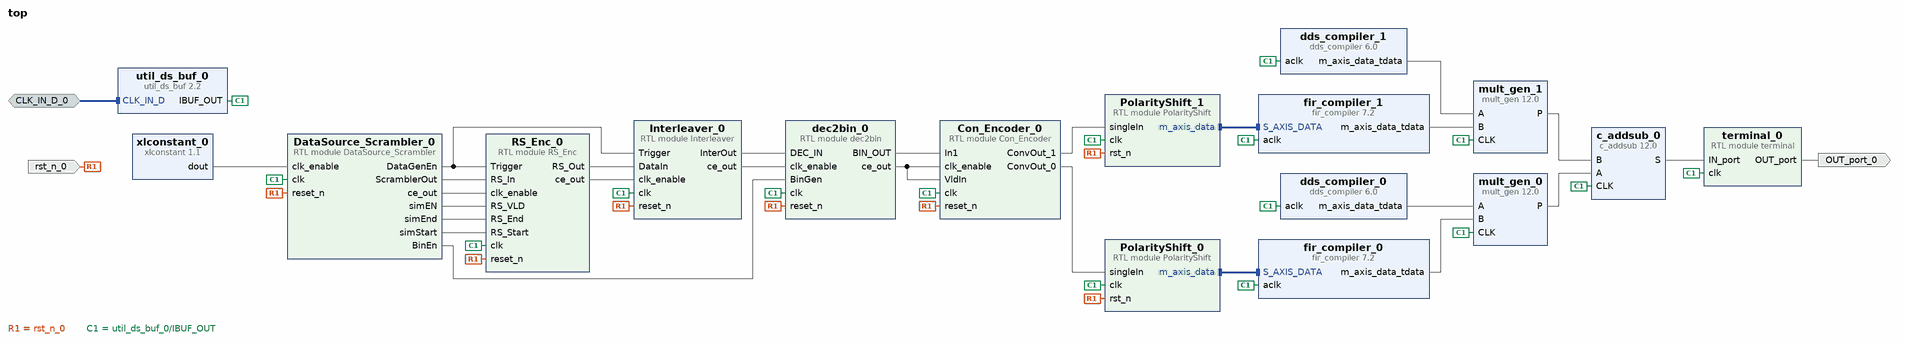
[diagram p0: block diagram of the top level]
# Vivado block design top, xc7k325tffg900-2, Vivado 2023.2
create_bd_design top

create_bd_intf_port -mode Slave -vlnv xilinx.com:interface:diff_clock_rtl:1.0 CLK_IN_D_0
create_bd_port -dir I -type rst rst_n_0
create_bd_port -dir O OUT_port_0

create_bd_cell -type ip -vlnv xilinx.com:ip:util_ds_buf:2.2 util_ds_buf_0
create_bd_cell -type module -reference Con_Encoder Con_Encoder_0
create_bd_cell -type ip -vlnv xilinx.com:ip:dds_compiler:6.0 dds_compiler_0
set_property -dict [list \
  CONFIG.DDS_Clock_Rate 200 \
  CONFIG.Frequency_Resolution 0.4 \
  CONFIG.Has_Phase_Out false \
  CONFIG.Latency 8 \
  CONFIG.M_DATA_Has_TUSER Not_Required \
  CONFIG.Noise_Shaping Auto \
  CONFIG.Output_Frequency1 50 \
  CONFIG.Output_Selection Sine \
  CONFIG.Output_Width 14 \
  CONFIG.PINC1 1000000000000000000000000000 \
  CONFIG.Phase_Width 29 \
  CONFIG.Spurious_Free_Dynamic_Range 80 \
] [get_bd_cells dds_compiler_0]
create_bd_cell -type ip -vlnv xilinx.com:ip:fir_compiler:7.2 fir_compiler_0
set_property -dict [list \
  CONFIG.Clock_Frequency 200 \
  CONFIG.CoefficientSource COE_File \
  CONFIG.Coefficient_File ../../../../../../../matlab/rcos.coe \
  CONFIG.Coefficient_Fractional_Bits 0 \
  CONFIG.Coefficient_Sets 1 \
  CONFIG.Coefficient_Sign Signed \
  CONFIG.Coefficient_Structure Inferred \
  CONFIG.Coefficient_Width 16 \
  CONFIG.ColumnConfig 41 \
  CONFIG.Data_Width 2 \
  CONFIG.Filter_Architecture Systolic_Multiply_Accumulate \
  CONFIG.Output_Rounding_Mode Full_Precision \
  CONFIG.Output_Width 21 \
  CONFIG.Quantization Integer_Coefficients \
  CONFIG.Sample_Frequency 200 \
] [get_bd_cells fir_compiler_0]
create_bd_cell -type module -reference PolarityShift PolarityShift_0
create_bd_cell -type module -reference PolarityShift PolarityShift_1
create_bd_cell -type ip -vlnv xilinx.com:ip:fir_compiler:7.2 fir_compiler_1
set_property -dict [list \
  CONFIG.Clock_Frequency 200 \
  CONFIG.CoefficientSource COE_File \
  CONFIG.Coefficient_File ../../../../../../../matlab/rcos.coe \
  CONFIG.Coefficient_Fractional_Bits 0 \
  CONFIG.Coefficient_Sets 1 \
  CONFIG.Coefficient_Sign Signed \
  CONFIG.Coefficient_Structure Inferred \
  CONFIG.Coefficient_Width 16 \
  CONFIG.ColumnConfig 41 \
  CONFIG.Data_Width 2 \
  CONFIG.Filter_Architecture Systolic_Multiply_Accumulate \
  CONFIG.Output_Rounding_Mode Full_Precision \
  CONFIG.Output_Width 21 \
  CONFIG.Quantization Integer_Coefficients \
  CONFIG.Sample_Frequency 200 \
] [get_bd_cells fir_compiler_1]
create_bd_cell -type ip -vlnv xilinx.com:ip:dds_compiler:6.0 dds_compiler_1
set_property -dict [list \
  CONFIG.DDS_Clock_Rate 200 \
  CONFIG.Frequency_Resolution 0.4 \
  CONFIG.Has_Phase_Out false \
  CONFIG.Latency 8 \
  CONFIG.M_DATA_Has_TUSER Not_Required \
  CONFIG.Noise_Shaping Auto \
  CONFIG.Output_Frequency1 50 \
  CONFIG.Output_Selection Sine \
  CONFIG.Output_Width 14 \
  CONFIG.PINC1 1000000000000000000000000000 \
  CONFIG.Phase_Width 29 \
  CONFIG.Spurious_Free_Dynamic_Range 80 \
] [get_bd_cells dds_compiler_1]
create_bd_cell -type ip -vlnv xilinx.com:ip:mult_gen:12.0 mult_gen_0
set_property -dict [list \
  CONFIG.Multiplier_Construction Use_Mults \
  CONFIG.OutputWidthHigh 40 \
  CONFIG.PipeStages 4 \
  CONFIG.PortAWidth 16 \
  CONFIG.PortBWidth 24 \
  CONFIG.Use_Custom_Output_Width true \
] [get_bd_cells mult_gen_0]
create_bd_cell -type ip -vlnv xilinx.com:ip:mult_gen:12.0 mult_gen_1
set_property -dict [list \
  CONFIG.Multiplier_Construction Use_Mults \
  CONFIG.OutputWidthHigh 40 \
  CONFIG.PipeStages 4 \
  CONFIG.PortAWidth 16 \
  CONFIG.PortBWidth 24 \
  CONFIG.Use_Custom_Output_Width true \
] [get_bd_cells mult_gen_1]
create_bd_cell -type ip -vlnv xilinx.com:ip:c_addsub:12.0 c_addsub_0
set_property -dict [list \
  CONFIG.A_Width 41 \
  CONFIG.B_Constant false \
  CONFIG.B_Value 00000000000000000000000000000000000000000 \
  CONFIG.B_Width 41 \
  CONFIG.CE false \
  CONFIG.Implementation DSP48 \
  CONFIG.Latency 2 \
  CONFIG.Latency_Configuration Automatic \
  CONFIG.Out_Width 41 \
] [get_bd_cells c_addsub_0]
create_bd_cell -type module -reference terminal terminal_0
create_bd_cell -type ip -vlnv xilinx.com:ip:xlconstant:1.1 xlconstant_0
create_bd_cell -type module -reference RS_Enc RS_Enc_0
create_bd_cell -type module -reference DataSource_Scrambler DataSource_Scrambler_0
create_bd_cell -type module -reference dec2bin dec2bin_0
create_bd_cell -type module -reference Interleaver Interleaver_0

# ---- connections ----

connect_bd_intf_net -intf_net CLK_IN_D_0_1 [get_bd_intf_ports CLK_IN_D_0] [get_bd_intf_pins util_ds_buf_0/CLK_IN_D]
connect_bd_intf_net [get_bd_intf_pins PolarityShift_0/m_axis_data] [get_bd_intf_pins fir_compiler_0/S_AXIS_DATA]
connect_bd_intf_net [get_bd_intf_pins PolarityShift_1/m_axis_data] [get_bd_intf_pins fir_compiler_1/S_AXIS_DATA]
connect_bd_net [get_bd_pins Con_Encoder_0/ConvOut_0] [get_bd_pins PolarityShift_0/singleIn]
connect_bd_net [get_bd_pins Con_Encoder_0/ConvOut_1] [get_bd_pins PolarityShift_1/singleIn]
connect_bd_net [get_bd_pins DataSource_Scrambler_0/BinEn] [get_bd_pins dec2bin_0/BinGen]
connect_bd_net [get_bd_pins DataSource_Scrambler_0/DataGenEn] [get_bd_pins Interleaver_0/Trigger] [get_bd_pins RS_Enc_0/Trigger]
connect_bd_net [get_bd_pins DataSource_Scrambler_0/ScramblerOut] [get_bd_pins RS_Enc_0/RS_In]
connect_bd_net [get_bd_pins DataSource_Scrambler_0/ce_out] [get_bd_pins RS_Enc_0/clk_enable]
connect_bd_net [get_bd_pins DataSource_Scrambler_0/simEN] [get_bd_pins RS_Enc_0/RS_VLD]
connect_bd_net [get_bd_pins DataSource_Scrambler_0/simEnd] [get_bd_pins RS_Enc_0/RS_End]
connect_bd_net [get_bd_pins DataSource_Scrambler_0/simStart] [get_bd_pins RS_Enc_0/RS_Start]
connect_bd_net [get_bd_pins Interleaver_0/InterOut] [get_bd_pins dec2bin_0/DEC_IN]
connect_bd_net [get_bd_pins Interleaver_0/ce_out] [get_bd_pins dec2bin_0/clk_enable]
connect_bd_net [get_bd_pins RS_Enc_0/RS_Out] [get_bd_pins Interleaver_0/DataIn]
connect_bd_net [get_bd_pins RS_Enc_0/ce_out] [get_bd_pins Interleaver_0/clk_enable]
connect_bd_net [get_bd_pins c_addsub_0/S] [get_bd_pins terminal_0/IN_port]
connect_bd_net [get_bd_pins dds_compiler_0/m_axis_data_tdata] [get_bd_pins mult_gen_0/A]
connect_bd_net [get_bd_pins dds_compiler_1/m_axis_data_tdata] [get_bd_pins mult_gen_1/A]
connect_bd_net [get_bd_pins dec2bin_0/BIN_OUT] [get_bd_pins Con_Encoder_0/In1]
connect_bd_net [get_bd_pins dec2bin_0/ce_out] [get_bd_pins Con_Encoder_0/clk_enable] [get_bd_pins Con_Encoder_0/VldIn]
connect_bd_net [get_bd_pins fir_compiler_0/m_axis_data_tdata] [get_bd_pins mult_gen_0/B]
connect_bd_net [get_bd_pins fir_compiler_1/m_axis_data_tdata] [get_bd_pins mult_gen_1/B]
connect_bd_net [get_bd_pins mult_gen_0/P] [get_bd_pins c_addsub_0/A]
connect_bd_net [get_bd_pins mult_gen_1/P] [get_bd_pins c_addsub_0/B]
connect_bd_net -net rst_n_0_1 [get_bd_ports rst_n_0] \
  [get_bd_pins PolarityShift_0/rst_n] [get_bd_pins PolarityShift_1/rst_n] [get_bd_pins Interleaver_0/reset_n] \
  [get_bd_pins dec2bin_0/reset_n] [get_bd_pins Con_Encoder_0/reset_n] [get_bd_pins DataSource_Scrambler_0/reset_n] \
  [get_bd_pins RS_Enc_0/reset_n]
connect_bd_net [get_bd_pins terminal_0/OUT_port] [get_bd_ports OUT_port_0]
connect_bd_net [get_bd_pins util_ds_buf_0/IBUF_OUT] \
  [get_bd_pins fir_compiler_0/aclk] [get_bd_pins dds_compiler_0/aclk] [get_bd_pins dds_compiler_1/aclk] \
  [get_bd_pins fir_compiler_1/aclk] [get_bd_pins mult_gen_0/CLK] [get_bd_pins mult_gen_1/CLK] [get_bd_pins c_addsub_0/CLK] \
  [get_bd_pins PolarityShift_0/clk] [get_bd_pins PolarityShift_1/clk] [get_bd_pins terminal_0/clk] \
  [get_bd_pins Interleaver_0/clk] [get_bd_pins dec2bin_0/clk] [get_bd_pins Con_Encoder_0/clk] \
  [get_bd_pins DataSource_Scrambler_0/clk] [get_bd_pins RS_Enc_0/clk]
connect_bd_net [get_bd_pins xlconstant_0/dout] [get_bd_pins DataSource_Scrambler_0/clk_enable]

validate_bd_design
save_bd_design
